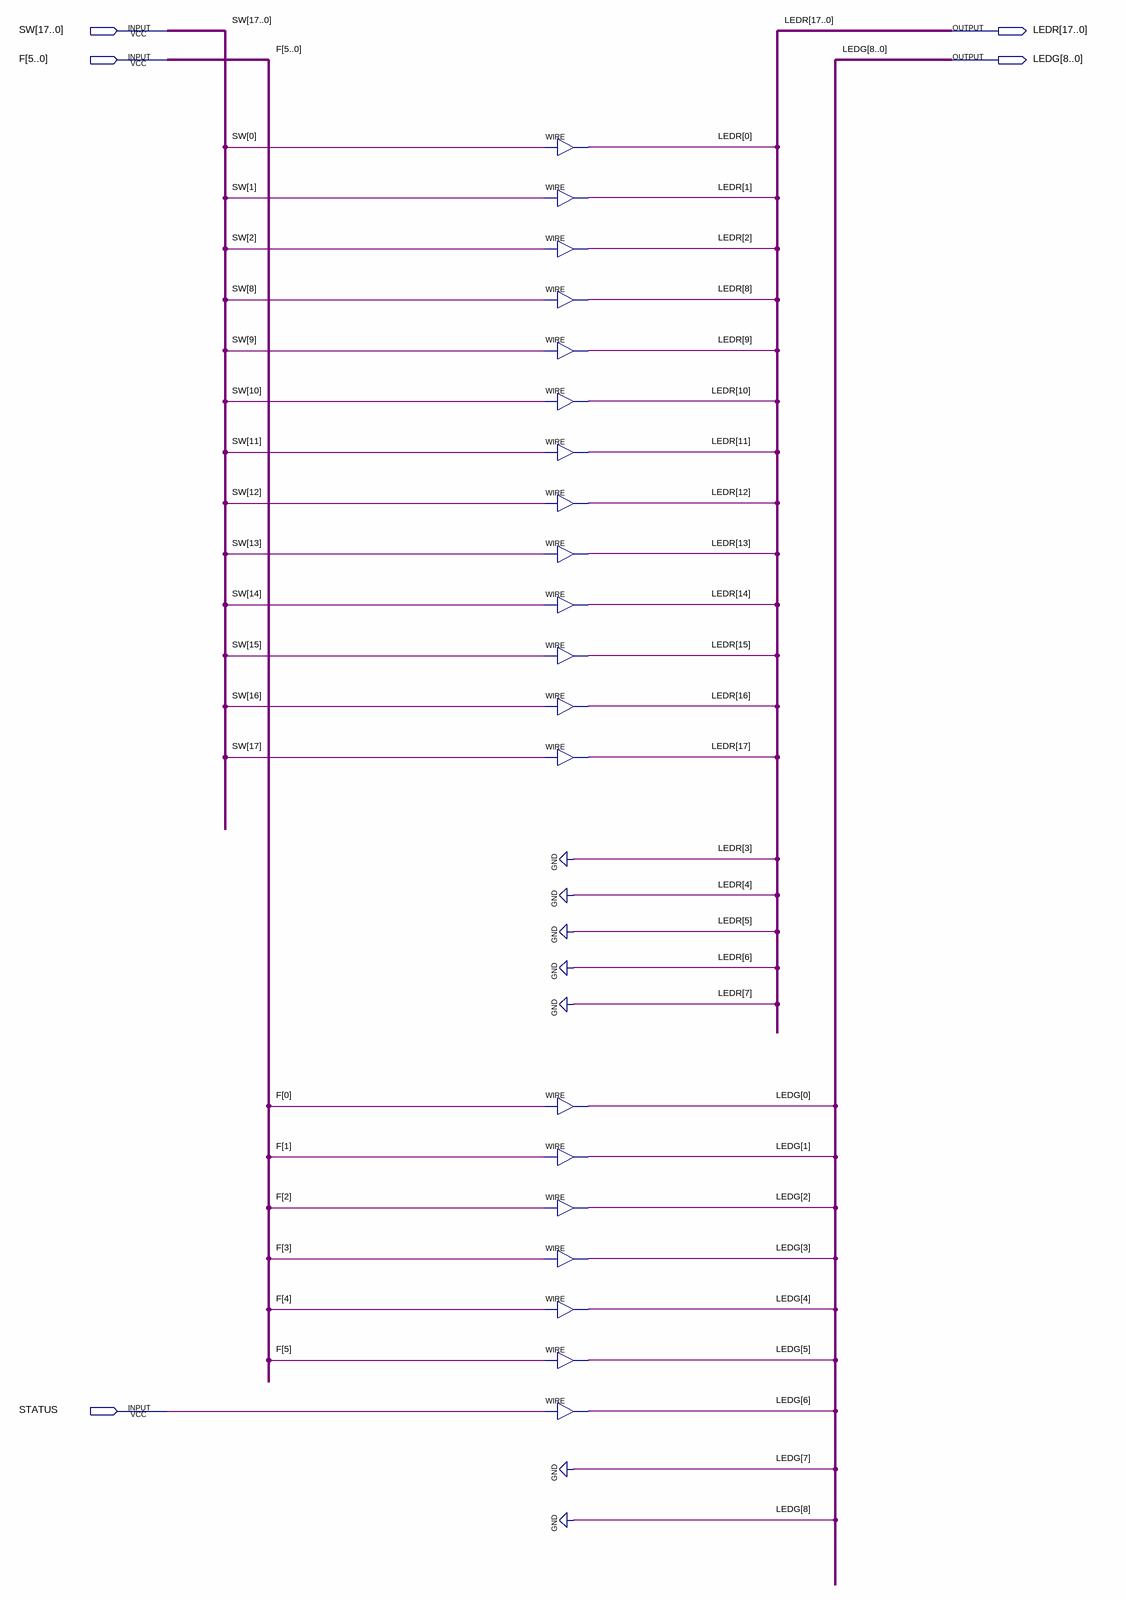
[diagram p0: schematic sheet]
// Quartus schematic LEDS_ULA.bdf as structural Verilog: 20 symbols, 5 pins
module LEDS_ULA (
  input  [17:0] SW,
  input  [5:0] F,
  input  STATUS,
  output [17:0] LEDR,
  output [8:0] LEDG
);

  assign LEDR[0] = SW[0];  // WIRE map_LEDR_0
  assign LEDR[1] = SW[1];  // WIRE map_LEDR_1
  assign LEDR[2] = SW[2];  // WIRE map_LEDR_2
  assign LEDR[8] = SW[8];  // WIRE map_LEDR_8
  assign LEDR[9] = SW[9];  // WIRE map_LEDR_9
  assign LEDR[10] = SW[10];  // WIRE map_LEDR_10
  assign LEDR[11] = SW[11];  // WIRE map_LEDR_11
  assign LEDR[12] = SW[12];  // WIRE map_LEDR_12
  assign LEDR[13] = SW[13];  // WIRE map_LEDR_13
  assign LEDR[14] = SW[14];  // WIRE map_LEDR_14
  assign LEDR[15] = SW[15];  // WIRE map_LEDR_15
  assign LEDR[16] = SW[16];  // WIRE map_LEDR_16
  assign LEDR[17] = SW[17];  // WIRE map_LEDR_17
  assign LEDG[0] = F[0];  // WIRE map_LEDG_0
  assign LEDG[1] = F[1];  // WIRE map_LEDG_1
  assign LEDG[2] = F[2];  // WIRE map_LEDG_2
  assign LEDG[3] = F[3];  // WIRE map_LEDG_3
  assign LEDG[4] = F[4];  // WIRE map_LEDG_4
  assign LEDG[5] = F[5];  // WIRE map_LEDG_5
  assign LEDG[6] = STATUS;  // WIRE status_led

  assign LEDG[8:7] = 2'b00;
  assign LEDR[7:3] = {5{1'b0}};
endmodule
